# EAGLE design spider_mx8_2side_serial (EAGLE 6.5.0)
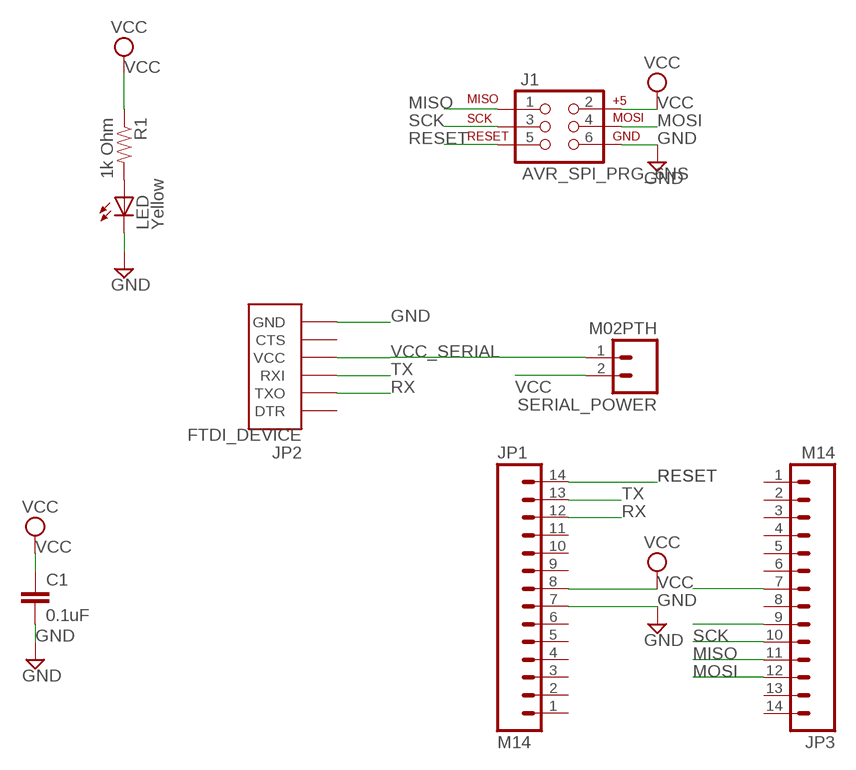
[diagram p0: schematic, sheet 1]

## Parts
C1  0.1uF  CAP1206  [1206]
J1  AVR_SPI_PRG_6NS  [2X3-NS]
JP1  M14  [1X14]
JP2  FTDI_DEVICE  [FTDI_DEVICE_SIDE]
JP3  M14  [1X14]
LED  Yellow  LED-YELLOWLILYPAD  [LED-1206]
R1  1k Ohm  RESISTOR1206  [1206]
SERIAL_POWER  M02PTH  [1X02]

## Nets
GND: C1.2 J1.6 JP1.7 JP2.P$6(GND) JP3.7 LED.C
MISO: J1.1 JP3.11
MOSI: J1.4 JP3.12
N$14: LED.A R1.2
RESET: J1.5 JP1.14
RX: JP1.12 JP2.P$2(TXO)
SCK: J1.3 JP3.10
TX: JP1.13 JP2.P$3(RXI)
VCC: C1.1 J1.2 JP1.8 JP3.9 R1.1 SERIAL_POWER.2
VCC_SERIAL: JP2.P$4(VCC) SERIAL_POWER.1
Unconnected: JP1.1 JP1.2 JP1.3 JP1.4 JP1.5 JP1.6 JP1.9 JP1.10 JP1.11 JP2.P$1(DTR) JP2.P$5(CTS) JP3.1 JP3.2 JP3.3 JP3.4 JP3.5 JP3.6 JP3.8 JP3.13 JP3.14

## Library data of the parts
C1 = SparkFun-Passives:CAP: Capacitor Standard 0603 ceramic capacitor, and 0.1" leaded capacitor.
J1 = SparkFun-Connectors:AVR_SPI_PRG_6: AVR ISP 6 Pin This is the reduced ISP connector for AVR programming. Common on Arduino. This footprint will take up less PCB space and can be used with a 10-pin to 6-pin adapter such as SKU: BOB-08508
JP1 JP3 = SparkFun-Connectors:M14: Header 14 Standard 14-pin 0.1" header. Use with straight break away headers (SKU : PRT-00116), right angle break away headers (PRT-00553), swiss pins (PRT-00743), machine pins (PRT-00117), and female headers (PRT-00115).
JP2 = SparkFun-Connectors:FTDI_DEVICE: Connector which mates to FTDI basic or FTDI cable.
LED = SparkFun-LED:LED-YELLOW: Yellow SMD LEDs LilyPad 1206- DIO-09909 0603- DIO-09003; PROD_ID: DIO-09909
R1 = SparkFun-Passives:RESISTOR: Resistor Basic schematic elements and footprints for 0603, 1206, and PTH resistors.
SERIAL_POWER = SparkFun-Connectors:M02: Standard 2-pin 0.1" header. Use with - straight break away headers ( PRT-00116) - right angle break away headers (PRT-00553) - swiss pins (PRT-00743) - machine pins (PRT-00117) - female headers (PRT-00115) Molex polarized connector foot print use with: PRT-08233 with associated crimp pins and housings. 2.54_SCREWTERM for use with PRT-10571. 3.5mm Screw Terminal footprints for PRT-08084 5mm Screw Terminal footprints for use with PRT-08433

## Board
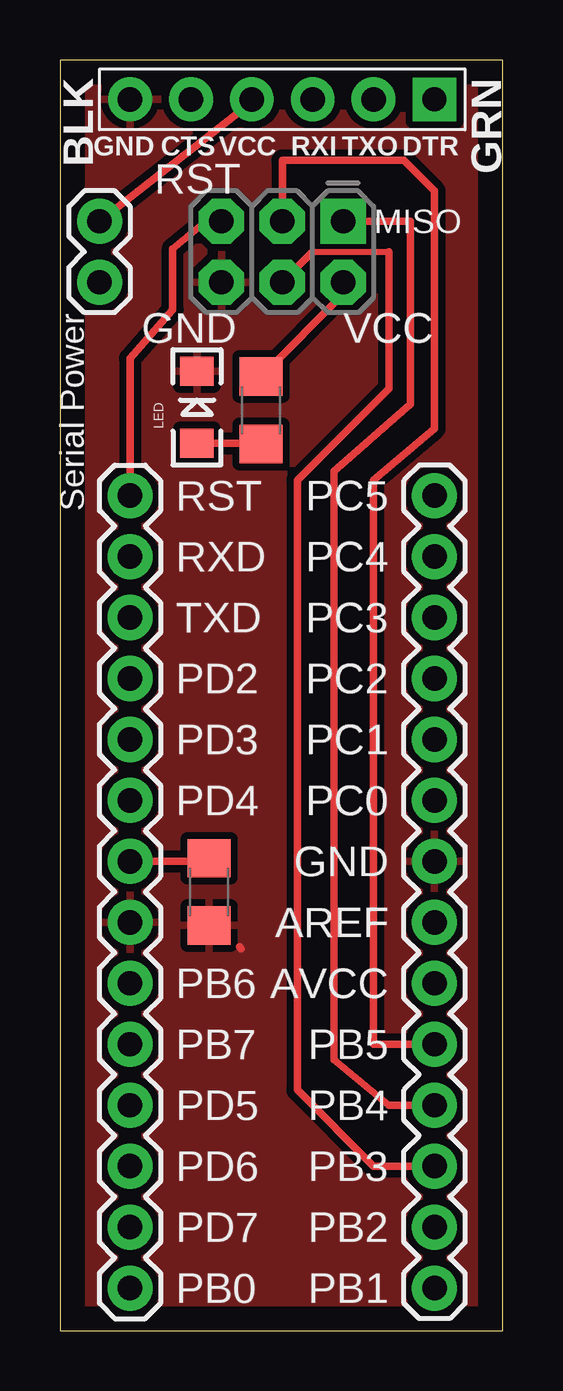
[diagram p1: board, top side]
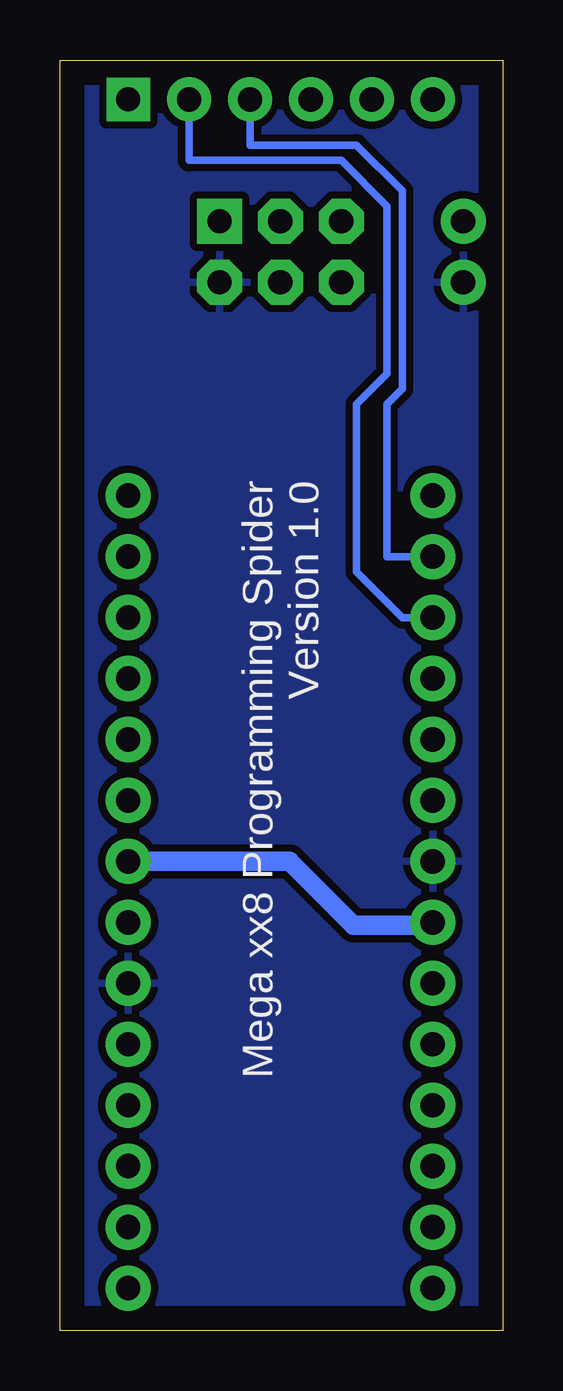
[diagram p2: board, bottom side, seen from below]

Size 18.47 x 52.95 mm. Coordinates in mm from the lower left corner, seen from the top.
Outline: 0,0 18.47,0 18.47,52.95 0,52.95 0,0
Copper layers (1*16): Top 0.035mm / dielectric 1.5mm / Bottom 0.035mm
Design rules "improved_12mil": minimum track width 12mil, minimum drill 0.8mm, track to track 12mil, track to pad 12mil, pad to pad 12mil, via to via 12mil, smd to smd 12mil, copper to edge 40mil, drill to drill 12mil, minimum pad ring 16mil, minimum via ring 16mil, stop-mask expansion 4mil, vias tented up to drill 0mil, thermal gap 12mil

### Footprints (pad centres in the part's own frame; a part is rotated, then mirrored left to right if it is on the bottom)
1206 = smd 1.6 x 1.8: 1 -1.4,0; 2 1.4,0
2X3-NS = drill 1.016 pad 1.88 square: 1 -2.54,-1.27 | drill 1.016 pad 1.88 octagon: 2 -2.54,1.27; 3 0,-1.27; 4 0,1.27; 5 2.54,-1.27; 6 2.54,1.27
1X14 = drill 1.016 pad 1.88: 1 0,0; 2 2.54,0; 3 5.08,0; 4 7.62,0; 5 10.16,0; 6 12.7,0; 7 15.24,0; 8 17.78,0; 9 20.32,0; 10 22.86,0; 11 25.4,0; 12 27.94,0; 13 30.48,0; 14 33.02,0
FTDI_DEVICE_SIDE = drill 1 square: P$1 -6.35,0 | drill 1.016 pad 1.778: P$2 -3.81,0; P$3 -1.27,0; P$4 1.27,0; P$5 3.81,0; P$6 6.35,0
LED-1206 = smd 1.2 x 1.4: A -1.5,0; C 1.5,0
1X02 = drill 1.016 pad 1.88: 1 0,0; 2 2.54,0

### Placement (x,y rotation side)
C1  6.22,18.29 270 top
J1  9.27,44.96 180 top
JP1  2.92,1.78 90 top
JP2  9.27,51.31 180 top
JP3  15.62,34.8 270 top
LED  5.72,38.48 90 top
R1  8.38,38.35 270 top
SERIAL_POWER  1.65,46.23 270 top

### Tracks (layer width: path | path; a pad name or v marks a point on that pad's centre or on a via)
GND
  Top 0.305: 6.22,17.02 C1.2 5.97,17.27 6.07,17.27 | 7.49,16 7.55,15.91 | 5.72,40.13 LED.C 5.97,40.13 5.86,40.13
  Bottom 0.813: JP3.7 8.89,19.56 C1.2 3.05,16.89 JP1.7
  pour Top: -0.25,59.56 -0.25,-0.76 20.7,-0.76 20.7,59.56
MISO
  Top 0.305: J1.1 14.61,46.23 14.61,38.61 11.43,35.81 11.43,11.3 13.72,9.4 JP3.11
MOSI
  Top 0.254: 10.54,44.96 13.72,44.96
  Top 0.305: J1.4 10.54,44.96 | 13.72,44.96 13.72,39.24 9.91,35.43 9.91,10.03 13.08,6.86 JP3.12
N$14
  Top 0.305: LED.A 8.36,36.98 R1.2
RESET
  Top 0.305: JP1.14 2.92,40.51 4.7,42.55 4.7,45.09 6.1,46.23 J1.5
RX
  Bottom 0.305: JP1.12 4.19,29.72 6.1,31.62 6.1,38.61 4.83,39.88 4.83,46.86 6.73,48.77 13.08,48.77 JP2.P$2
SCK
  Top 0.305: J1.3 9.27,48.77 14.35,48.77 15.62,47.5 15.62,37.59 13.08,35.43 13.08,11.94 JP3.10
TX
  Bottom 0.305: JP2.P$3 10.54,49.4 6.1,49.4 4.19,47.5 4.19,39.24 4.83,38.61 4.83,32.26 JP1.13
VCC
  Top 0.305: JP1.8 6.22,19.56 C1.1 | J1.2 11.81,43.18 8.51,39.88 R1.1
  pour Bottom: -0.89,59.56 -0.89,-0.76 20.07,-0.76 20.07,59.56
VCC_SERIAL
  Top 0.254: 7.49,50.8 JP2.P$4
  Top 0.305: SERIAL_POWER.1 7.49,50.8

### Text on the board
tNames: RST | MISO | GND | VCC | Serial Power | RST | PC5 | RXD | PC4 | TXD | PC3 | PD2 | PC2 | PD3 | PC1 | PD4 | PC0 | GND | AREF | PB6 | AVCC | PB7 | PB5 | PD5 | PB4 | PD6 | PB3 | PD7 | PB2 | PB0 | PB1
bNames: Mega xx8 Programming Spider / Version 1.0